# Altium schematic sheet Sheet1.SchDoc
size A4
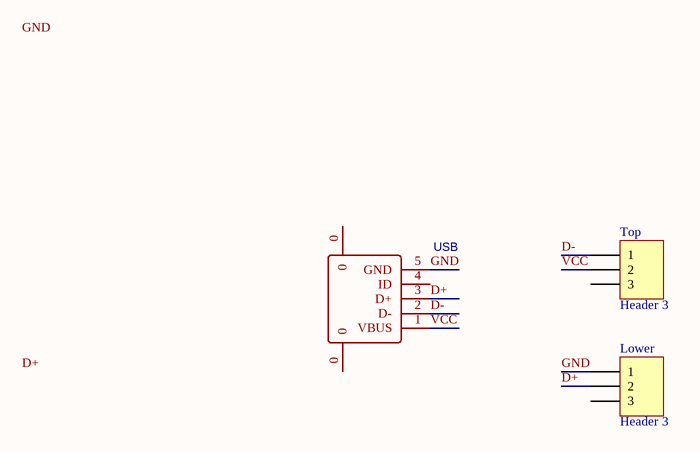
[diagram p0: Sheet1.SchDoc]

## Parts
Lower  Header 3  [HDR1X3]
Top  Header 3  [HDR1X3]
USB  (no value)  [MICROUSB-5S]

## Nets
D+: Lower.2 USB.3(D+)
D-: Top.1 USB.2(D-)
GND: Lower.1 USB.5(GND)
VCC: Top.2 USB.1(VBUS)

Not connected (* = marked no-connect by the designer): Lower 3; Top 3; USB 0 4(ID)

## Notes on the sheet
- Labels drawn without touching a wire or pin: D+, GND

## Library data of the parts
Lower Top = Header 3: Header, 3-Pin; LatestRevisionDate: 17-Jul-2002; LatestRevisionNote: Re-released for DXP Platform.; Publisher: Altium Limited
USB = Micro USB 母座 5P